# Altium schematic sheet DATN2022.Debug.SchDoc
size A
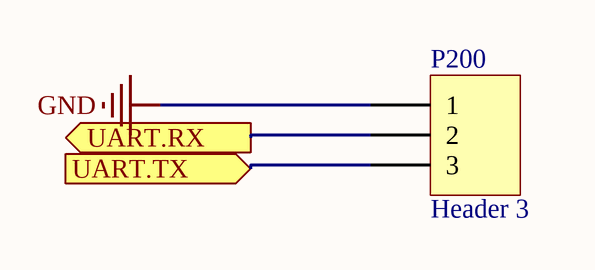
[diagram p0: DATN2022.Debug.SchDoc]

## Parts
P200  Header 3  [HDR1X3]

## Ports
UART.RX (out), UART.TX (in)

## Nets
GND: P200.1
UART.RX: P200.2 ; port UART.RX
UART.TX: P200.3 ; port UART.TX

## Library data of the parts
P200 = Header 3: Header, 3-Pin; LatestRevisionDate: 17-Jul-2002; LatestRevisionNote: Re-released for DXP Platform.; Publisher: Altium Limited